# EAGLE design diagram (EAGLE 8.2.2)
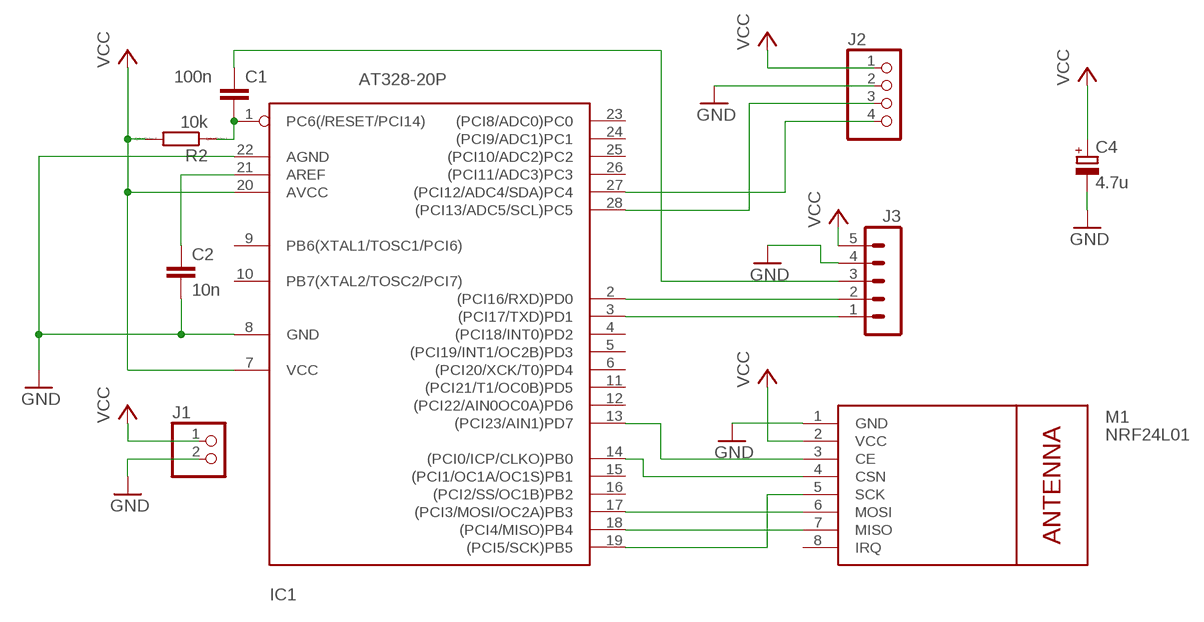
[diagram p0: schematic, sheet 1]

## Parts
C1  100n  C-EU050-024X044  [C050-024X044]
C2  10n  C-EU050-024X044  [C050-024X044]
C4  4.7u  CPOL-EUE1.8-4  [E1,8-4]
IC1  AT328-20P  ATMEGA328-20P  [DIL28-3]
J1  PINHD-1X2  [1X02]
J2  PINHD-1X4  [1X04]
J3  MA05-1  [MA05-1]
M1  NRF24L01  WIRELESS-NRF24L01  [WIRELESS-NRF24L01]
R2  10k  R0204/7  [0204/7]

## Nets
GND: C2.2 C4.- IC1.8(GND) IC1.22(AGND) J1.2 J2.2 J3.4 M1.1(GND)
N$1: C1.2 IC1.1(PC6(/RESET/PCI14)) R2.1
N$2: IC1.18((PCI4/MISO)PB4) M1.7(MISO)
N$3: IC1.19((PCI5/SCK)PB5) M1.5(SCK)
N$4: IC1.17((PCI3/MOSI/OC2A)PB3) M1.6(MOSI)
N$5: IC1.3((PCI17/TXD)PD1) J3.1
N$6: IC1.2((PCI16/RXD)PD0) J3.2
N$7: IC1.28((PCI13/ADC5/SCL)PC5) J2.3
N$8: C1.1 J3.3
N$9: IC1.27((PCI12/ADC4/SDA)PC4) J2.4
N$10: IC1.14((PCI0/ICP/CLKO)PB0) M1.4(CSN)
N$11: IC1.13((PCI23/AIN1)PD7) M1.3(CE)
N$12: C2.1 IC1.21(AREF)
VCC: C4.+ IC1.7(VCC) IC1.20(AVCC) J1.1 J2.1 J3.5 M1.2(VCC) R2.2
Unconnected: IC1.4((PCI18/INT0)PD2) IC1.5((PCI19/INT1/OC2B)PD3) IC1.6((PCI20/XCK/T0)PD4) IC1.9(PB6(XTAL1/TOSC1/PCI6)) IC1.10(PB7(XTAL2/TOSC2/PCI7)) IC1.11((PCI21/T1/OC0B)PD5) IC1.12((PCI22/AIN0OC0A)PD6) IC1.15((PCI1/OC1A/OC1S)PB1) IC1.16((PCI2/SS/OC1B)PB2) IC1.23((PCI8/ADC0)PC0) IC1.24((PCI9/ADC1)PC1) IC1.25((PCI10/ADC2)PC2) IC1.26((PCI11/ADC3)PC3) M1.8(IRQ)

## Library data of the parts
C1 C2 = rcl:C-EU: CAPACITOR, European symbol
C4 = resistor:CPOL-EU: POLARIZED CAPACITOR, European symbol
IC1 = atmega328:ATMEGA328*P: MICROCONTROLLER 32 kBytes FLASH 2 kBytes SRAM 1 kBytes EEPROM USART 8-channel 10 bit ADC
J1 = pinhead:PINHD-1X2: PIN HEADER
J2 = pinhead:PINHD-1X4: PIN HEADER
J3 = con-lstb:MA05-1: PIN HEADER; OC_FARNELL: unknown; OC_NEWARK: unknown
M1 = diy-modules:WIRELESS-NRF24L01: 2.4 GHz Wireless Module based on NRF24L01 chip More details available here: http://www.electrodragon.com/w/NRF24L01 Click here to find device on ebay.com <http://www.ebay.com/sch/nrf24l01+arduino>
R2 = eagle-ltspice:R: RESISTOR, European symbol; SPICEMODEL: NONE; SPICEPREFIX: R

## Net classes
0 default: width 0.305 mm, drill 0.508 mm, clearance 0.254 mm

## Board
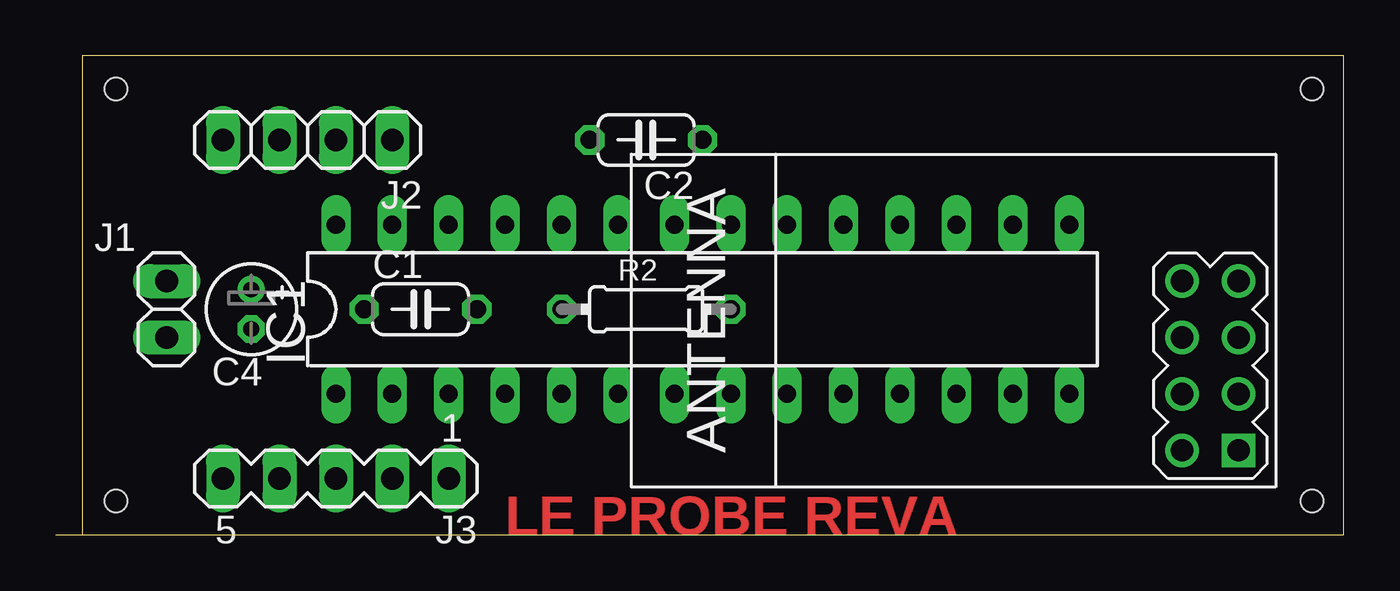
[diagram p1: board, top side]
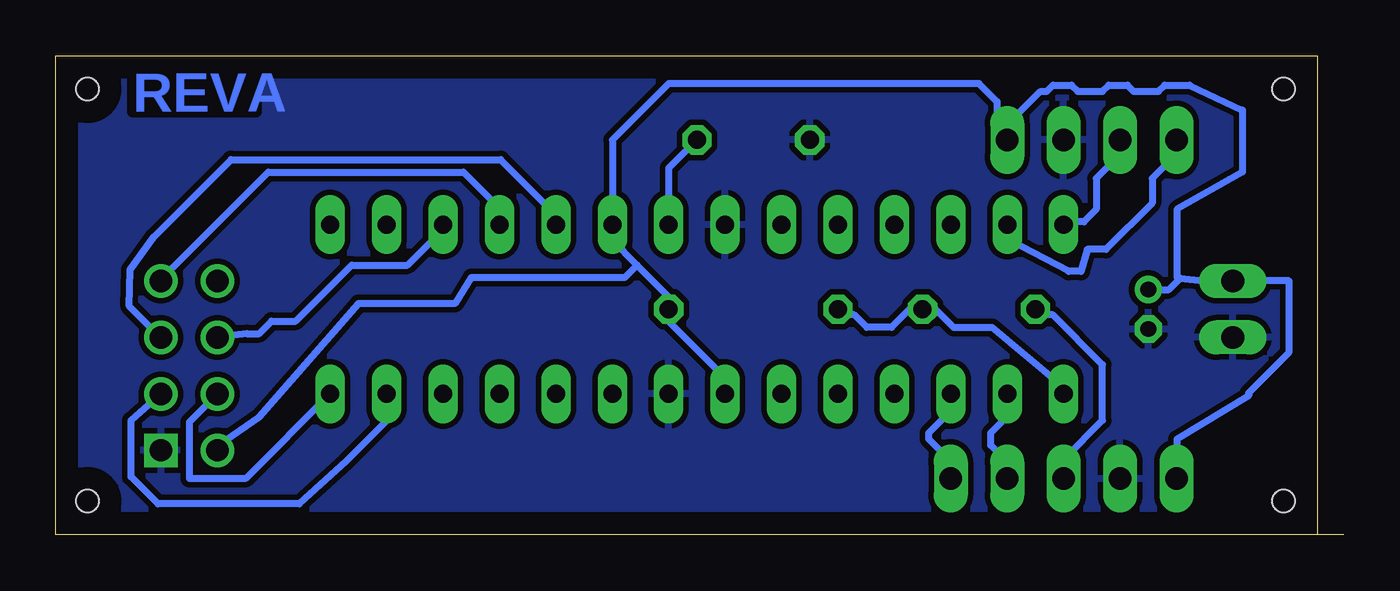
[diagram p2: board, bottom side, seen from below]

Size 58.01 x 21.58 mm. Coordinates in mm from the lower left corner, seen from the top.
Outline: 0,0 58.01,0 58.01,0.33 58.01,21.58 1.19,21.58 1.19,0
Copper layers (1*16): Top 0.035mm / dielectric 1.5mm / Bottom 0.035mm
Design rules "default": minimum track width 6mil, minimum drill 0.35mm, track to track 6mil, track to pad 6mil, pad to pad 6mil, via to via 6mil, smd to smd 6mil, copper to edge 40mil, drill to drill 6mil, minimum pad ring 10mil, minimum via ring 8mil, stop-mask expansion 4mil, vias tented up to drill 0mil, thermal gap 10mil
Holes 1 mm at 2.72,20.07 2.72,1.52 56.57,20.07 56.57,1.52

### Footprints (pad centres in the part's own frame; a part is rotated, then mirrored left to right if it is on the bottom)
C050-024X044 = drill 0.813 octagon: 1 -2.54,0; 2 2.54,0
E1,8-4 = drill 0.711 pad 1.168: + -0.889,0 | drill 0.711 pad 1.168 octagon: - 0.889,0
DIL28-3 = drill 0.813 long: 1 -16.51,-3.81; 2 -13.97,-3.81; 3 -11.43,-3.81; 4 -8.89,-3.81; 5 -6.35,-3.81; 6 -3.81,-3.81; 7 -1.27,-3.81; 8 1.27,-3.81; 9 3.81,-3.81; 10 6.35,-3.81; 11 8.89,-3.81; 12 11.43,-3.81; 13 13.97,-3.81; 14 16.51,-3.81; 15 16.51,3.81; 16 13.97,3.81; 17 11.43,3.81; 18 8.89,3.81; 19 6.35,3.81; 20 3.81,3.81; 21 1.27,3.81; 22 -1.27,3.81; 23 -3.81,3.81; 24 -6.35,3.81; 25 -8.89,3.81; 26 -11.43,3.81; 27 -13.97,3.81; 28 -16.51,3.81
1X02 = drill 1.016 long: 1 -1.27,0; 2 1.27,0
1X04 = drill 1.016 long: 1 -3.81,0; 2 -1.27,0; 3 1.27,0; 4 3.81,0
MA05-1 = drill 1.016 long: 1 -5.08,0; 2 -2.54,0; 3 0,0; 4 2.54,0; 5 5.08,0
WIRELESS-NRF24L01 = drill 1 square: 1 -12.7,6.35 | drill 1: 2 -10.16,6.35; 3 -12.7,3.81; 4 -10.16,3.81; 5 -12.7,1.27; 6 -10.16,1.27; 7 -12.7,-1.27; 8 -10.16,-1.27
0204/7 = drill 0.813 octagon: 1 -3.81,0; 2 3.81,0

### Placement (x,y rotation side)
C1  16.43,10.16 0 top
C2  26.59,17.78 180 top
C4  8.81,10.16 270 top
IC1  29.13,10.16 0 top
J1  5,10.16 270 top
J2  11.35,17.78 180 top
J3  12.62,2.54 180 top
M1  40.56,10.16 180 top
R2  26.59,10.16 0 top

### Tracks (layer width: path | path; a pad name or v marks a point on that pad's centre or on a via)
GND
  pour Bottom: -0.08,22.86 -0.08,-1.27 59.61,-1.27 59.61,22.86
N$1
  Bottom 0.305: 18.97,10.19 18.41,10.19 17.58,9.35 15.85,9.35 12.83,6.83 12.83,6.55 IC1.1 | 18.97,10.19 19.53,10.19 20.37,9.35 21.49,9.35 22.05,9.91 22.61,9.91 R2.1 | 18.97,10.19 C1.2
N$2
  Bottom 0.305: IC1.18 38.25,14.1 38.25,14.94 39.65,16.33 48.44,16.33 53.19,11.58 M1.7
N$3
  Bottom 0.305: IC1.19 35.74,14.1 35.74,14.66 37.97,16.89 50.11,16.89 53.59,13.41 54.66,11.94 54.69,10.29 53.3,8.89 M1.5
N$4
  Bottom 0.305: IC1.17 40.77,13.82 40.77,13.54 42.16,12.14 44.68,12.14 47.19,9.63 48.29,9.63 48.84,9.07 49.4,9.07 M1.6
N$5
  Bottom 0.305: IC1.3 17.86,6.27 17.86,5.44 18.69,4.6 18.69,4.32 17.86,3.48 17.86,2.64 J3.1
N$6
  Bottom 0.305: IC1.2 15.34,6.27 15.34,5.16 15.9,4.6 15.9,4.04 15.34,3.48 15.34,2.64 J3.2
N$7
  Bottom 0.305: IC1.28 12.55,14.1 11.71,14.1 11.15,14.66 11.15,16.05 10.31,16.89 10.31,17.73 J2.3
N$8
  Bottom 0.305: C1.1 13.66,9.91 13.11,9.91 10.87,7.67 10.87,5.16 12.55,3.48 12.55,2.64 J3.3
N$9
  Bottom 0.305: IC1.27 15.06,13.82 15.06,13.26 12.39,11.86 11.84,11.86 11.56,12.85 10.72,12.85 8.64,14.94 8.64,16.05 7.8,16.89 7.8,17.73 J2.4
N$10
  Bottom 0.305: IC1.14 49.45,2.54 51.99,2.54 51.99,5.08 M1.4
N$11
  Bottom 0.305: M1.3 54.61,5.16 54.61,2.62 53.39,1.4 47.03,1.4 44.92,3.33 43.1,5.15 IC1.13
N$12
  Bottom 0.305: C2.1 30.4,16.51 IC1.21
VCC
  Bottom 0.305: J3.5 7.52,2.64 7.52,4.32 4.29,6.27 4.29,6.4 2.46,8.23 2.46,11.44 6.32,11.44 | 30.43,10.19 30.71,9.91 27.91,7.11 27.91,6.55 IC1.7 | 31.83,12.14 30.43,10.74 30.43,10.19 | 31.83,12.14 32.94,13.26 IC1.20 32.94,17.78 30.4,20.32 16.43,20.32 15.62,19.51 15.62,18.01 | 30.43,10.19 R2.2 | 31.83,12.14 32.38,11.58 39.29,11.58 40.03,10.41 44.37,10.41 48.84,5.31 50.67,4.04 M1.2 | 15.62,18.01 15.34,18.01 J2.1 15.62,18.01 | 15.62,18.01 13.66,19.96 13.39,19.96 13.11,20.24 12.27,20.24 11.99,19.96 10.87,19.96 10.59,20.24 9.75,20.24 9.47,19.96 8.36,19.96 8.08,20.24 6.96,20.24 4.57,19.13 4.57,16.33 7.52,14.66 7.52,11.58 7.38,11.56 | 7.38,11.56 6.32,11.44 | 6.32,11.44 J1.1 | C4.+ 7.89,11.05 7.38,11.56

### Text on the board
Top: LE PROBE REVA
Bottom: REVA